# Altium schematic sheet Display.SchDoc: SoldeerStation
size A4; Author: Ceyhan Yildiz; Address1: PXL EAI 1001; Revision: V 1.0; SheetNumber: 1; SheetTotal: 1
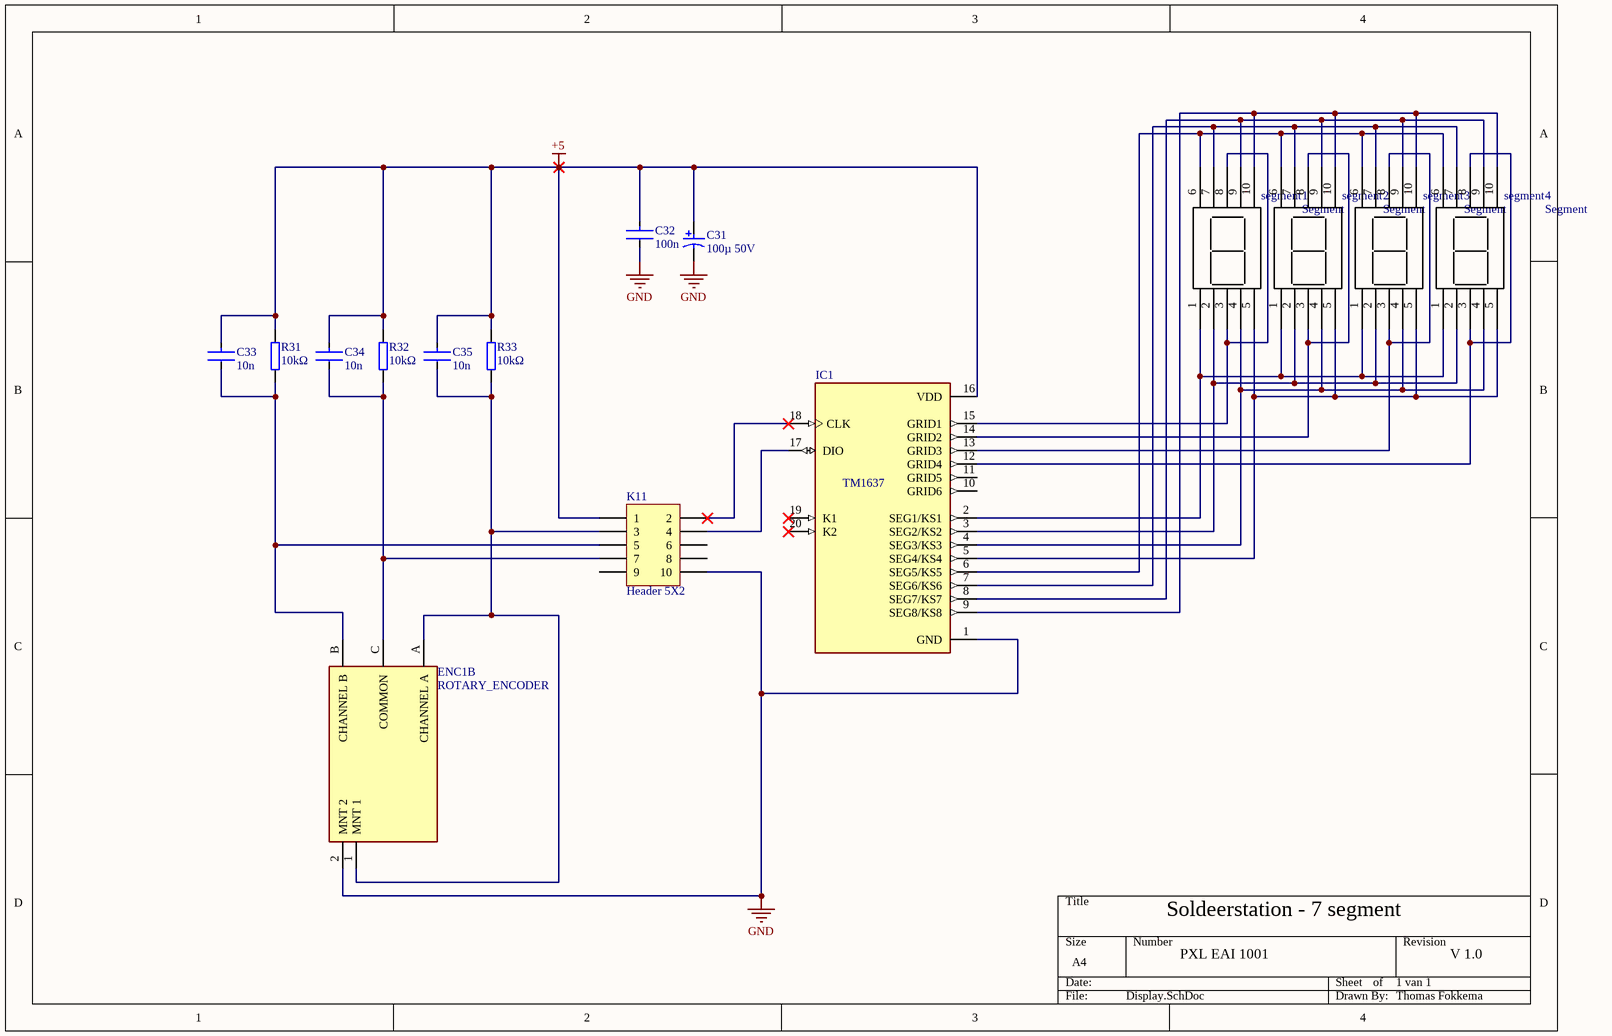
[diagram p0: Display.SchDoc]

## Parts
1  Segment  [Segement]
2  Segment  [Segement]
3  Segment  [Segement]
4  Segment  [Segement]
C31  100µ 50V  [CE_D8_L10]
C32  100n  [CC_0805_L]
C33  10n  [CC_0805_L]
C34  10n  [CC_0805_L]
C35  10n  [CC_0805_L]
ENC1B  ROTARY_ENCODER  [PEC11R_4220F_S0012]
IC1  TM1637  [SOP_20_M]
K11  Header 5X2  [HDR2X5]
R31  10kΩ  [R_0805_M]
R32  10kΩ  [R_0805_M]
R33  10kΩ  [R_0805_M]

## Nets
+5: C31.2 C32.1 C33.1 C34.1 C35.1 IC1.16(VDD) K11.1 R31.2 R32.2 R33.2
GND: C31.1 C32.2 ENC1B.2(MNT_2) IC1.1(GND) K11.10
Net1_1: 1.1 2.1 3.1 4.1 IC1.2(SEG1/KS1)
Net1_2: 1.2 2.2 3.2 4.2 IC1.3(SEG2/KS2)
Net1_3: 1.3 1.8 IC1.15(GRID1)
Net1_4: 1.4 2.4 3.4 4.4 IC1.4(SEG3/KS3)
Net1_5: 1.5 2.5 3.5 4.5 IC1.5(SEG4/KS4)
Net1_6: 1.6 2.6 3.6 4.6 IC1.6(SEG5/KS5)
Net1_7: 1.7 2.7 3.7 4.7 IC1.7(SEG6/KS6)
Net1_9: 1.9 2.9 3.9 4.9 IC1.8(SEG7/KS7)
Net1_10: 1.10 2.10 3.10 4.10 IC1.9(SEG8/KS8)
Net2_3: 2.3 2.8 IC1.14(GRID2)
Net3_3: 3.3 3.8 IC1.13(GRID3)
Net4_3: 4.3 4.8 IC1.12(GRID4)
NetC33_2: C33.2 ENC1B.B(CHANNEL_B) K11.5 R31.1
NetC34_2: C34.2 ENC1B.C(COMMON) K11.7 R32.1
NetC35_2: C35.2 ENC1B.1(MNT_1) ENC1B.A(CHANNEL_A) K11.3 R33.1
NetIC1_17: IC1.17(DIO) K11.4
NetIC1_18: IC1.18(CLK) K11.2

Not connected (* = marked no-connect by the designer): IC1 10(GRID6) 11(GRID5) 19(K1)* 20(K2)*; K11 6 8 9

## Notes on the sheet
- Soldeerstation - 7 segment
- Thomas Fokkema
- (in symbol Segment) segment

## Library data of the parts
C31 = Capacitor_Electrolytic: Manufacturer: Panasonic; Voltage Rating: 25 V; ComponentLink2URL: http://industrial.panasonic.com/cdbs/www-data/pdf/RDE0000/ABA0000C1181.pdf; Height: 10.2 mm; Max Operating Temperature: 105 degC; PackageReference: EEE-FK1E221P; ComponentLink1Description: Manufacturer URL; ComponentLink1URL: http://www.panasonic.com/; Mount: Surface Mount; REACH SVHC: No SVHC; Min Operating Temperature: -55 degC; ComponentLink2Description: Datasheet; DatasheetVersion: 03/2016; Length: 10.2 mm; RoHSCompliant: true; Packaging: Tape and Reel; Package Quantity: 500; Lead Pitch: 3.1 mm; Pins: 2; PackageDescription: 2-Pin Electrolytic Aluminum Capacitor, Body 8.3 x 8.3 mm; Mounting Technology: Surface Mount
C32-C35 = Capacitor_Ceramic: Manufacturer: KEMET; Manufacturer Part Number: C0805C224K5RACTU; Value: 0.22 μF; Temperature Characteristic: X7R; Temperature Coefficient: 30ppm/°C; Tolerance: 0.1; Voltage Rating: 50 V; ComponentLink2URL: https://content.kemet.com/datasheets/KEM_C1003_C0G_SMD.pdf; Device Class L3: Ceramic Capacitors; Lead Free: Yes; Temperature: -55°C to +125°C; RoHS: TRUE; Capacitance: 0.22 μF; Automotive: No; Material: Ceramic; Octopart: https://octopart.com/c0805c224k5ractu-kemet-144670; Temperature Range Low: -55°C; Height: 0.88mm; Device Class L1: Passive Components; Digikey Description: CAP CER 0.22UF 50V X7R 0805; ComponentLink2Description: Datasheet; Mouser Description: CAP CER 0.22UF 50V X7R 0805; Category: Cap; Ipc Land Pattern Name: CAPC200125X78; Temperature Range High: +125°C; Package: C0805C-DN; Device Class L2: Capacitors
ENC1B = ROTARY_ENCODER: Manufacturer Part Number: PEC11R-4015F-N0024; Manufacturer: Bourns; Current Rating: 10mA; Number Of Circuits: 1; Conn Orientation: Vertical; Encoder Type: Incremental; Detent: No; Pulses Per Rev: 24; Voltage Rating Dc: 5V; Height: 22.3mm; ComponentLink2URL: https://www.bourns.com/docs/product-datasheets/pec11r.pdf?sfvrsn=bb617cbf_7; Mouser Description: Encoders 15mm SHAFT NO SWITCH; Package: 0; RoHS: TRUE; Temperature Range High: +70°C; Device Class L1: Electromechanical; Device Class L3: Encoders; Temperature Range Low: -30°C; Device Class L2: Switches; Temperature: -30°C to +70°C; Category: Enc; ComponentLink2Description: Datasheet; Lead Free: Yes; Automotive: No; Octopart: https://octopart.com/pec11r-4015f-n0024-bourns-26648251; Digikey Description: ROTARY ENCODER MECHANICAL 24PPR
IC1 = TM1637: LED Drive Control Special Circuit; MF: Titan Micro Electronics; Package: Package; Availability: Not in stock; SnapEDA_Link: https://www.snapeda.com/parts/TM1637/Titan+Micro+Electronics/view-part/?ref=snap; MP: TM1637; Check_prices: https://www.snapeda.com/parts/TM1637/Titan+Micro+Electronics/view-part/?ref=eda; Value: *; Price: None
K11 = Header 5X2: Header, 5-Pin, Dual row; LatestRevisionDate: 17-Jul-2002; LatestRevisionNote: Re-released for DXP Platform.; Publisher: Altium Limited
R31-R33 = Resistor: Manufacturer: Vishay Dale; Part Number: CRCW08050000Z0EA